# EAGLE design emitter - Copy (EAGLE 6.5.0)
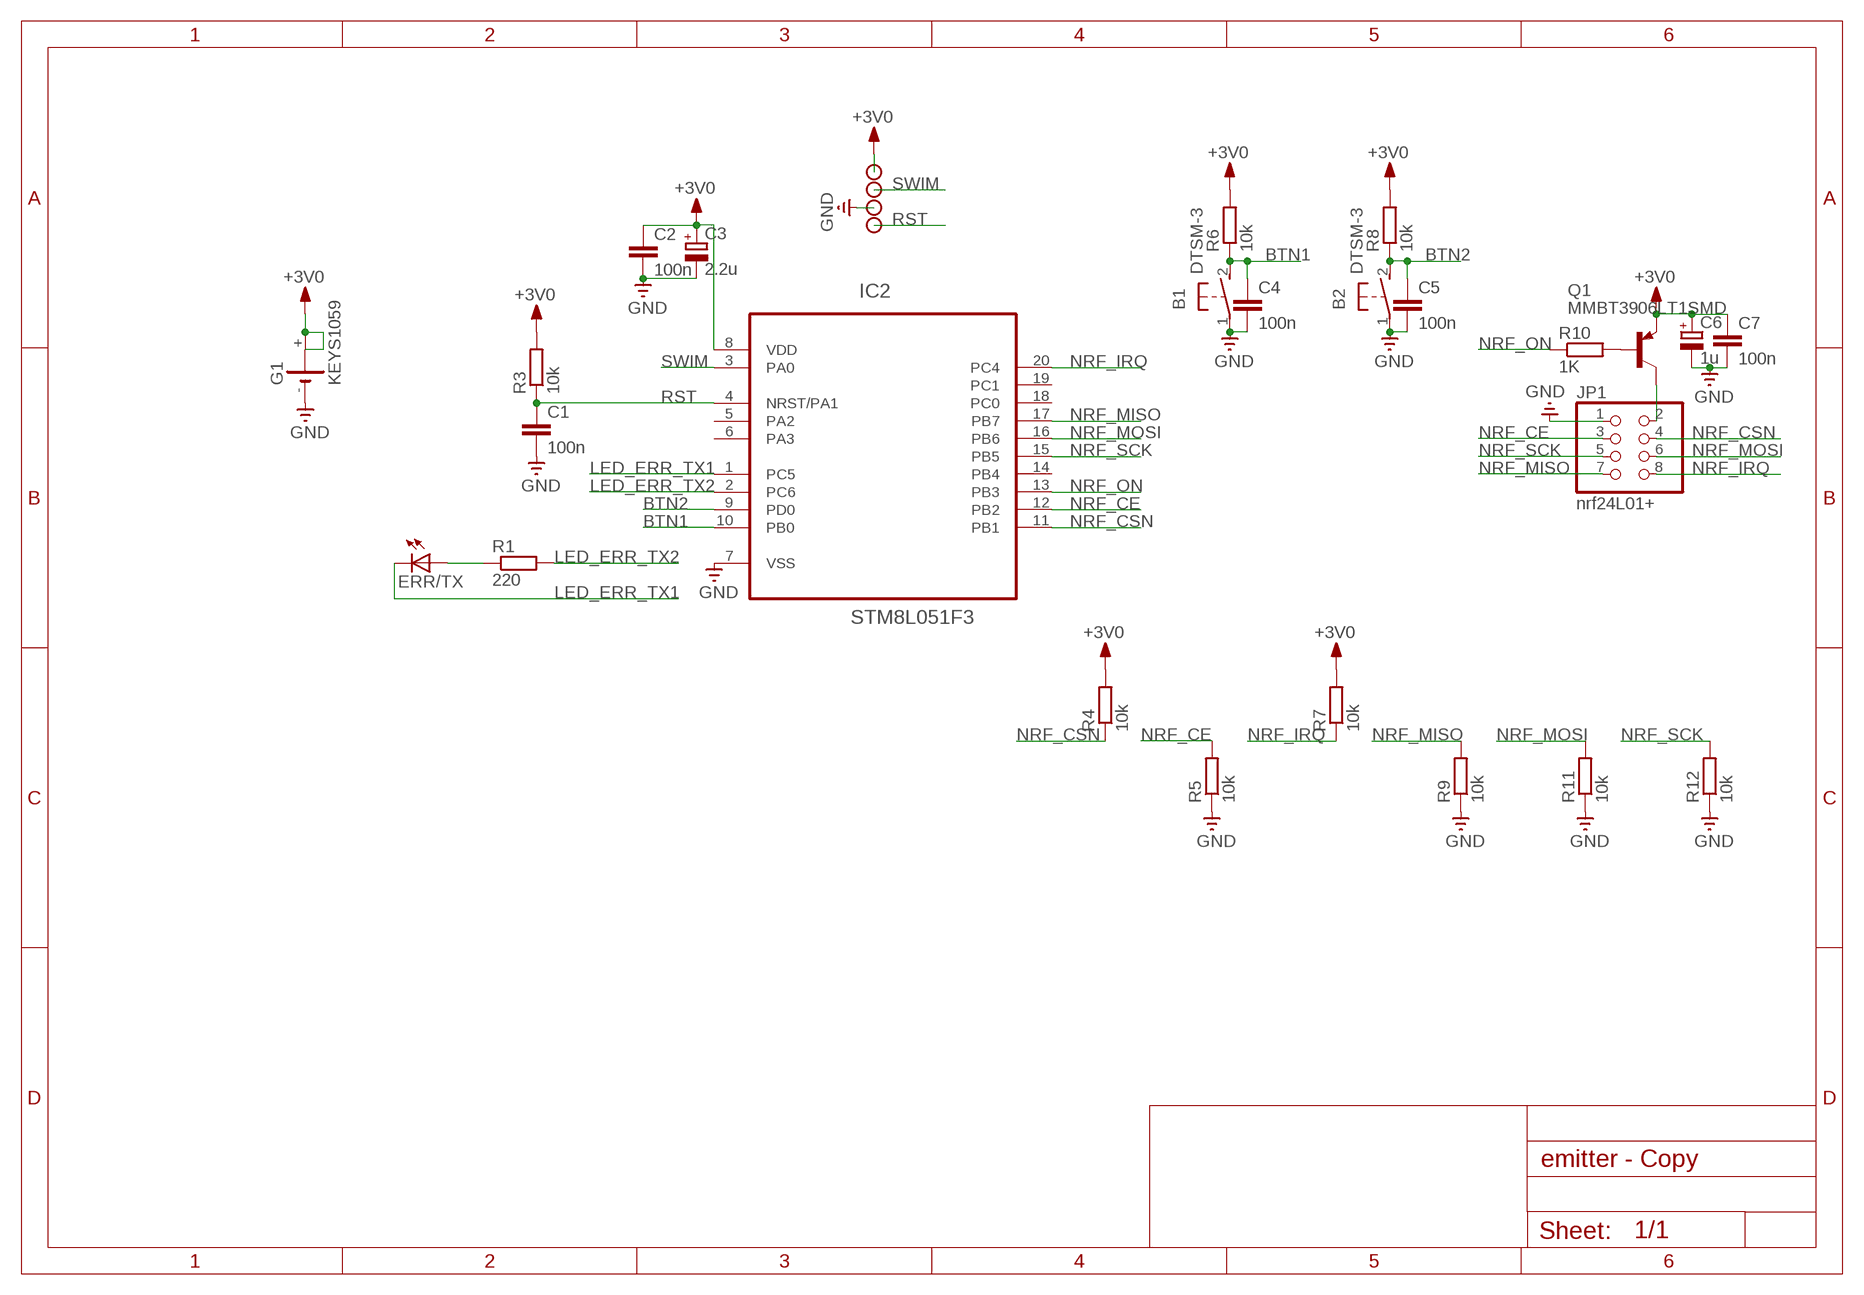
[diagram p0: schematic, sheet 1]

## Parts
B1  DTSM-3  [DTSM-3]
B2  DTSM-3  [DTSM-3]
C1  100n  C-EUC0603K  [C0603K]
C2  100n  C-EUC0603K  [C0603K]
C3  2.2u  CPOL-EUSMCA  [SMC_A]
C4  100n  C-EUC0603K  [C0603K]
C5  100n  C-EUC0603K  [C0603K]
C6  1u  CPOL-EUSMCA  [SMC_A]
C7  100n  C-EUC0603K  [C0603K]
ERR/TX  LED3MM  [LED3MM]
G1  KEYS1059  [KEYS1059]
IC2  STM8L051F3  [TSSOP20]
JP1  nrf24L01+  PINHD-2X4  [2X04]
Q1  MMBT3906LT1SMD  [SOT23-BEC]
R1  220  R-EU_R0603  [R0603]
R3  10k  R-EU_R0603  [R0603]
R4  10k  R-EU_R0603  [R0603]
R5  10k  R-EU_R0603  [R0603]
R6  10k  R-EU_R0603  [R0603]
R7  10k  R-EU_R0603  [R0603]
R8  10k  R-EU_R0603  [R0603]
R9  10k  R-EU_R0603  [R0603]
R10  1K  R-EU_R0603  [R0603]
R11  10k  R-EU_R0603  [R0603]
R12  10k  R-EU_R0603  [R0603]
SIG_+3V1  CON_PAD  [SMD_PAD]
SIG_GND  CON_PAD  [SMD_PAD]
SIG_RST  CON_PAD  [SMD_PAD]
SIG_SWIM  CON_PAD  [SMD_PAD]

## Nets
+3V0: C2.1 C3.+ C6.+ C7.1 G1.+ G1.@+(+) IC2.8(VDD) Q1.E R3.2 R4.2 R6.2 R7.2 R8.2 SIG_+3V1.P$1
BTN1: B1.2 C4.1 IC2.10(PB0) R6.1
BTN2: B2.2 C5.1 IC2.9(PD0) R8.1
GND: B1.1 B2.1 C1.2 C2.2 C3.- C4.2 C5.2 C6.- C7.2 G1.- IC2.7(VSS) JP1.1 R5.1 R9.1 R11.1 R12.1 SIG_GND.P$1
LED_ERR_TX1: ERR/TX.K(C) IC2.1(PC5)
LED_ERR_TX2: IC2.2(PC6) R1.2
N$1: ERR/TX.A R1.1
N$4: JP1.2 Q1.C
N$8: Q1.B R10.2
NRF_CE: IC2.12(PB2) JP1.3 R5.2
NRF_CSN: IC2.11(PB1) JP1.4 R4.1
NRF_IRQ: IC2.20(PC4) JP1.8 R7.1
NRF_MISO: IC2.17(PB7) JP1.7 R9.2
NRF_MOSI: IC2.16(PB6) JP1.6 R11.2
NRF_ON: IC2.13(PB3) R10.1
NRF_SCK: IC2.15(PB5) JP1.5 R12.2
RST: C1.1 IC2.4(NRST/PA1) R3.1 SIG_RST.P$1
SWIM: IC2.3(PA0) SIG_SWIM.P$1
Unconnected: IC2.5(PA2) IC2.6(PA3) IC2.14(PB4) IC2.18(PC0) IC2.19(PC1)

## Library data of the parts
B1 B2 = switch-tact:DTSM-3
C1 C2 C4 C5 C7 = resistor:C-EU: CAPACITOR, European symbol
C3 C6 = resistor:CPOL-EU: POLARIZED CAPACITOR, European symbol
ERR/TX = led:LED: LED OSRAM: - CHIPLED LG R971, LG N971, LY N971, LG Q971, LY Q971, LO R971, LY R971 LH N974, LH R974 LS Q976, LO Q976, LY Q976 LO Q996 - Hyper CHIPLED LW Q18S LB Q993, LB Q99A, LB R99A - SideLED LS A670, LO A670, LY A670, LG A670, LP A670 LB A673, LV A673, LT A673, LW A673 LH A674 LY A675 LS A676, LA A676, LO A676, LY A676, LW A676 LS A679, LY A679, LG A679 - Hyper Micro SIDELED® LS Y876, LA Y876, LO Y876, LY Y876 LT Y87S - SmartLED LW L88C, LW L88S LB L89C, LB L89S, LG L890 LS L89K, LO L89K, LY L89K LS L896, LA L896, LO L896, LY L896 - TOPLED LS T670, LO T670, LY T670, LG T670, LP T670 LSG T670, LSP T670, LSY T670, LOP T670, LYG T670 LG T671, LOG T671, LSG T671 LB T673, LV T673, LT T673, LW T673 LH T674 LS T676, LA T676, LO T676, LY T676, LB T676, LH T676, LSB T676, LW T676 LB T67C, LV T67C, LT T67C, LS T67K, LO T67K, LY T67K, LW E67C LS E67B, LA E67B, LO E67B, LY E67B, LB E67C, LV E67C, LT E67C LW T67C LS T679, LY T679, LG T679 LS T770, LO T770, LY T770, LG T770, LP T770 LB T773, LV T773, LT T773, LW T773 LH T774 LS E675, LA E675, LY E675, LS T675 LS T776, LA T776, LO T776, LY T776, LB T776 LHGB T686 LT T68C, LB T68C - Hyper Mini TOPLED® LB M676 - Mini TOPLED Santana® LG M470 LS M47K, LO M47K, LY M47K Source: http://www.osram.convergy.de LUXEON: - LUMILED® LXK2-PW12-R00, LXK2-PW12-S00, LXK2-PW14-U00, LXK2-PW14-V00 LXK2-PM12-R00, LXK2-PM12-S00, LXK2-PM14-U00 LXK2-PE12-Q00, LXK2-PE12-R00, LXK2-PE12-S00, LXK2-PE14-T00, LXK2-PE14-U00 LXK2-PB12-K00, LXK2-PB12-L00, LXK2-PB12-M00, LXK2-PB14-N00, LXK2-PB14-P00, LXK2-PB14-Q00 LXK2-PR12-L00, LXK2-PR12-M00, LXK2-PR14-Q00, LXK2-PR14-R00 LXK2-PD12-Q00, LXK2-PD12-R00, LXK2-PD12-S00 LXK2-PH12-R00, LXK2-PH12-S00 LXK2-PL12-P00, LXK2-PL12-Q00, LXK2-PL12-R00 Source: www.luxeon.com KINGBRIGHT: KA-3528ASYC Source: www.kingbright.com
G1 = componente_RFSwitch:KEYS1059
IC2 = componente_CarRF:STM8L051F3
JP1 = pinhead:PINHD-2X4: PIN HEADER
Q1 = transistor-pnp:MMBT3906*: PNP Transistror
R1 R3-R12 = resistor:R-EU_: RESISTOR, European symbol
SIG_+3V1 SIG_GND SIG_RST SIG_SWIM = componente_RFSwitch:CON_PAD

## Board
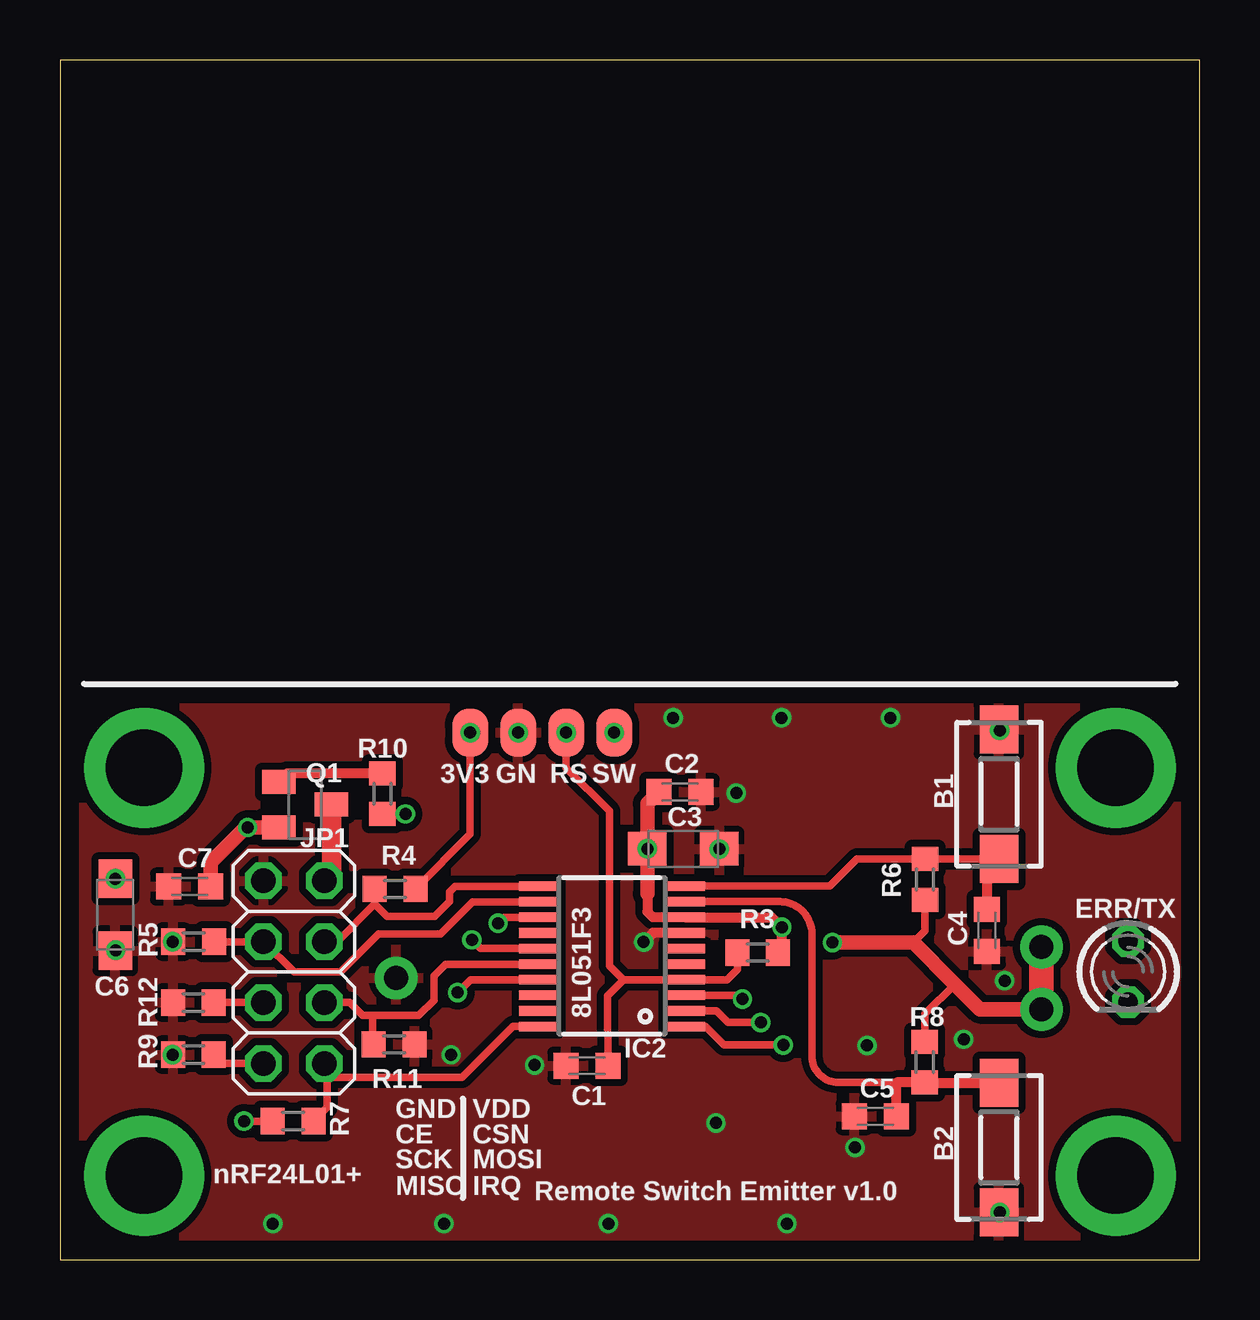
[diagram p1: board, top side]
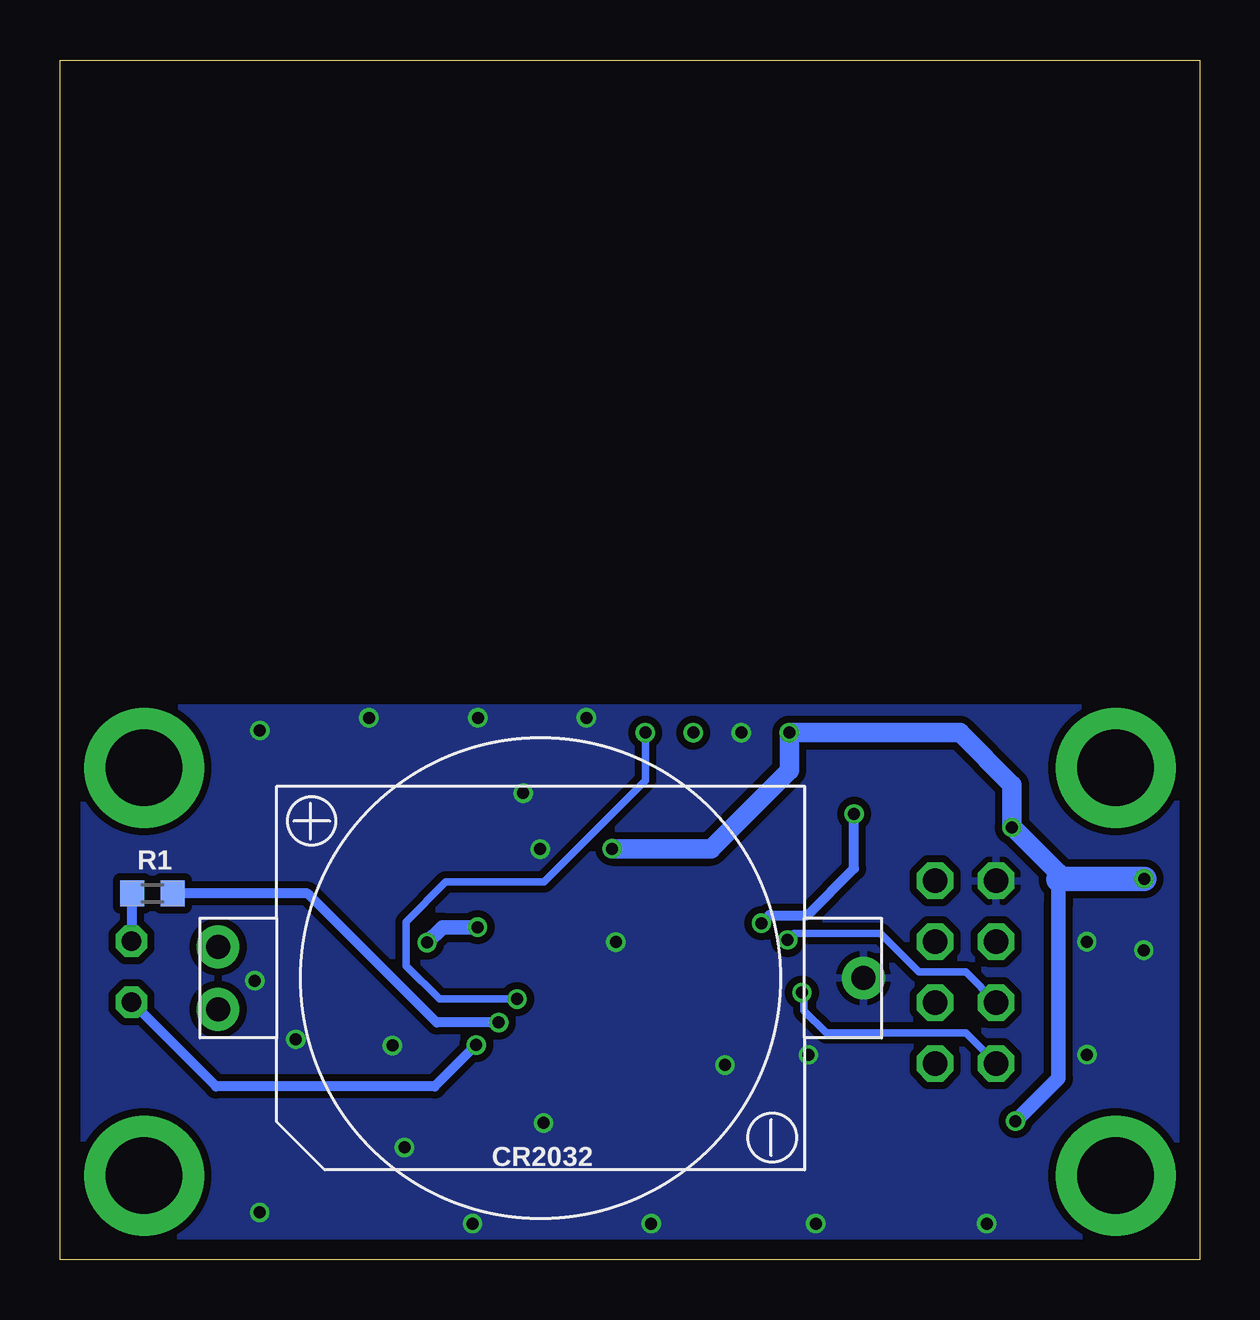
[diagram p2: board, bottom side, seen from below]

Size 47.5 x 50 mm. Coordinates in mm from the lower left corner, seen from the top.
Outline: 47.5,50 0,50 0,0 47.5,0 47.5,50
Copper layers (1*16): Top 0.035mm / dielectric 1.5mm / Bottom 0.035mm
Design rules "SeeedStudio_2layer_DRU_no_angle_20140221": minimum track width 6mil, minimum drill 12mil, track to track 6mil, track to pad 6mil, pad to pad 6mil, via to via 6mil, smd to smd 0mil, copper to edge 10mil, drill to drill 10mil, minimum pad ring 10mil, minimum via ring 6mil, stop-mask expansion 2mil, vias tented up to drill 100mil, thermal gap 10mil

### Footprints (pad centres in the part's own frame; a part is rotated, then mirrored left to right if it is on the bottom)
DTSM-3 = smd 2 x 1.6: 1 -2.7,0; 2 2.7,0
C0603K = smd 1.05 x 1.08: 1 -0.875,0; 2 0.875,0
SMC_A = smd 1.6 x 1.4: + -1.5,0; - 1.5,0
LED3MM = drill 0.813 octagon: A -1.27,0; K 1.27,0
KEYS1059 = drill 1 pad 1.778: + 13.45,1.3; - -13.45,0; @+ 13.45,-1.3
TSSOP20 = smd 0.4 x 1.65: 1 -3.575,-3.05; 2 -2.925,-3.05; 3 -2.275,-3.05; 4 -1.625,-3.05; 5 -0.975,-3.05; 6 -0.325,-3.05; 7 0.325,-3.05; 8 0.975,-3.05; 9 1.625,-3.05; 10 2.275,-3.05; 11 2.275,3.05; 12 1.625,3.05; 13 0.975,3.05; 14 0.325,3.05; 15 -0.325,3.05; 16 -0.975,3.05; 17 -1.625,3.05; 18 -2.275,3.05; 19 -2.925,3.05; 20 -3.575,3.05
2X04 = drill 1.016 octagon: 1 -3.81,-1.27; 2 -3.81,1.27; 3 -1.27,-1.27; 4 -1.27,1.27; 5 1.27,-1.27; 6 1.27,1.27; 7 3.81,-1.27; 8 3.81,1.27
SOT23-BEC = smd 1 x 1.4: B -0.95,-1.1; C 0,1.1; E 0.95,-1.1
R0603 = smd 1 x 1.1: 1 -0.85,0; 2 0.85,0
SMD_PAD = smd 2 x 1.5: P$1 0,0

### Placement (x,y rotation side)
B1  39.14,19.39 270 top
B2  39.14,4.67 90 top
C1  21.97,8.08 180 top
C2  25.84,19.49 0 top
C3  25.98,17.12 0 top
C4  38.64,13.72 270 top
C5  33.99,5.97 180 top
C6  2.31,14.37 270 top
C7  5.41,15.55 180 top
ERR/TX  44.52,12 270 top
G1  27.46,11.73 180 bottom
IC2  23.01,13.29 90 top
JP1  9.75,11.98 270 top
Q1  10.22,18.96 270 top
R1  43.65,15.26 0 bottom
R3  29.08,12.8 0 top
R4  13.97,15.45 0 top
R5  5.57,13.25 0 top
R6  36.06,15.84 270 top
R7  9.72,5.77 180 top
R8  36.04,8.23 90 top
R9  5.56,8.54 0 top
R10  13.44,19.42 90 top
R11  13.93,8.97 180 top
R12  5.56,10.71 0 top
SIG_+3V1  17.1,21.96 90 top
SIG_GND  19.1,21.96 90 top
SIG_RST  21.1,21.96 90 top
SIG_SWIM  23.1,21.96 90 top

### Tracks (layer width: path | path; a pad name or v marks a point on that pad's centre or on a via)
+3V0  (via drill 0.5)
  Top 0.305: IC2.8 | R8.2 36.06,9.1 36.06,10.23 37.3,11.47 | R6.2 36.06,13.7 35.57,13.21 | R7.2 v7.67,5.77 | R4.2 17.1,17.73 SIG_+3V1.P$1
  Top 0.406: IC2.8 29.68,14.27 v30.09,13.85 30.09,12.96 R3.2 | IC2.8 24.71,14.27 24.48,14.5 24.48,15.26
  Top 0.61: v32.2,13.21 35.57,13.21 37.3,11.47 38.35,10.43 G1.+ | Q1.E v7.82,18.01 7.74,18.01 6.29,16.56 C7.1 | C2.1 24.48,19 C3.+ 24.48,15.26
  Top 1.016: G1.+ G1.@+
  Bottom 0.61: 5.89,16.11 5.89,15.84 5.89,14.8 5.88,14.79 5.88,7.55 5.89,7.55 v7.67,5.77 | v7.82,18.01 7.79,18.01 | v32.2,13.21 31.56,13.85 v30.09,13.85
  Bottom 0.813: 7.79,18.01 5.89,16.11 | C3.+ 20.37,17.12 17.1,20.39 SIG_+3V1.P$1 10,21.96 7.82,19.78 v7.82,18.01
  Bottom 1.016: C6.+ 5.86,15.87 5.89,15.84
  other vias: 2.31,15.87 17.1,21.96 24.48,17.12
BTN1
  Top 0.305: IC2.10 32.1,15.57 33.22,16.69 R6.1 B1.2
  Top 0.406: B1.2 38.64,16.69 C4.1
BTN2
  Top 0.305: R8.1 | 34.87,7.38 32.45,7.38 arc-90 31.34,8.49 31.34,13.58 arc90 30,14.92 IC2.9 arc90 IC2.9
  Top 0.406: R8.1 B2.2 | R8.1 34.87,7.38 C5.1
GND  (via drill 0.5)
  Top 0.406: IC2.7 24.71,13.62 v24.33,13.23
  other vias: 4.7,13.25 4.69,8.54 8.87,1.5 19.78,8.11 16.3,8.53 33.14,4.67 25.56,22.58 16,1.5 28.19,19.44 34.62,22.58 30.08,22.58 27.34,5.69 39.17,22.05 22.86,1.5 30.3,1.5 39.18,1.96 33.64,8.92 27.48,17.11 37.67,9.18 2.32,12.89 19.1,21.96 39.38,11.62
  pour Top (isolate 0.3): 1,23 46.5,23 46.5,1 1,1
  pour Bottom (isolate 0.3): 1,1 46.5,1 46.5,23 1,23
LED_ERR_TX1  (via drill 0.5)
  Top 0.305: IC2.1 26.91,9.71 27.68,8.94 v30.15,8.94
  Bottom 0.406: v30.15,8.94 31.88,7.21 41,7.21 ERR/TX.K
LED_ERR_TX2  (via drill 0.5)
  Top 0.305: IC2.2 arc-90 IC2.2 27.36,10.37 27.84,9.88 v29.21,9.88
  Bottom 0.406: v29.21,9.88 31.8,9.88 37.18,15.26 R1.2
N$1
  Bottom 0.406: R1.1 44.52,15.26 ERR/TX.A
N$3  (via drill 3.2 pad 5)
  other vias: 3.5,20.5
N$4
  Top 0.813: Q1.C 11.32,16.09 JP1.2
N$5  (via drill 3.2 pad 5)
  other vias: 44,20.5
N$6  (via drill 3.2 pad 5)
  other vias: 3.5,3.5
N$7  (via drill 3.2 pad 5)
  other vias: 44,3.5
N$8
  Top 0.406: R10.2 9.48,20.27 Q1.B
NRF_CE
  Top 0.305: R5.2 JP1.3 9.75,11.98 11.69,11.98 13.29,13.58 15.87,13.58 17.2,14.91 IC2.12
NRF_CSN
  Top 0.305: IC2.11 16.46,15.56 16.23,15.33 16.23,14.92 15.61,14.3 13.64,14.3 13.12,14.82 | R4.1 13.12,14.82 | 13.12,14.82 11.55,13.25 JP1.4
NRF_IRQ
  Top 0.305: 11.14,7.59 16.77,7.59 18.89,9.71 IC2.20 | R7.1 11.14,6.34 11.14,7.59 | 11.14,7.59 11.02,7.71 JP1.8
NRF_MISO  (via drill 0.5)
  Top 0.305: v16.57,11.13 17.11,11.66 IC2.17 | JP1.7 6.78,8.17 R9.2
  Bottom 0.305: JP1.7 8.48,8.19 9.73,9.44 15.55,9.44 16.48,10.37 16.48,11.04 v16.57,11.13
NRF_MOSI
  Top 0.305: JP1.6 12.08,10.71 12.62,10.17 13.04,10.17 | 13.04,10.17 14.95,10.17 15.59,10.81 15.59,11.82 16.08,12.31 IC2.16 | R11.2 13.04,9.01 13.04,10.17
NRF_ON  (via drill 0.5)
  Top 0.305: IC2.13 18.5,14.27 v18.26,14.02
  Top 0.406: R10.1 v14.4,18.57
  Bottom 0.406: v18.26,14.02 17.93,14.35 16.35,14.35 14.4,16.3 v14.4,18.57
NRF_SCK  (via drill 0.5)
  Top 0.305: R12.2 JP1.5 | IC2.15 17.53,12.96 v17.17,13.32
  Bottom 0.305: JP1.5 9.75,11.98 11.69,11.98 13.3,13.59 16.9,13.59 v17.17,13.32
RST  (via drill 0.5)
  Top 0.305: 23.5,11.66 IC2.4 27.8,11.66 28.23,12.1 R3.1 | 23.5,11.66 22.82,10.99 C1.1 | 23.5,11.66 22.91,12.25 22.91,18.69 21.1,20.5 SIG_RST.P$1
  other vias: 21.1,21.96
SWIM  (via drill 0.5)
  Top 0.305: IC2.3 28.3,11.02 v28.45,10.86
  Bottom 0.305: v28.45,10.86 31.68,10.86 33.07,12.25 33.07,14.08 31.42,15.73 27.32,15.73 23.09,19.96 SIG_SWIM.P$1
  other vias: 23.1,21.96

### Text on the board
tPlace: 8L051F3
bPlace: CR2032
tNames: 3V3 | GN | RS | SW | GND | VDD | CE | CSN | SCK | MOSI | nRF24L01+ | MISO | IRQ | Remote Switch Emitter v1.0